# Altium schematic sheet Power.SchDoc
size A4
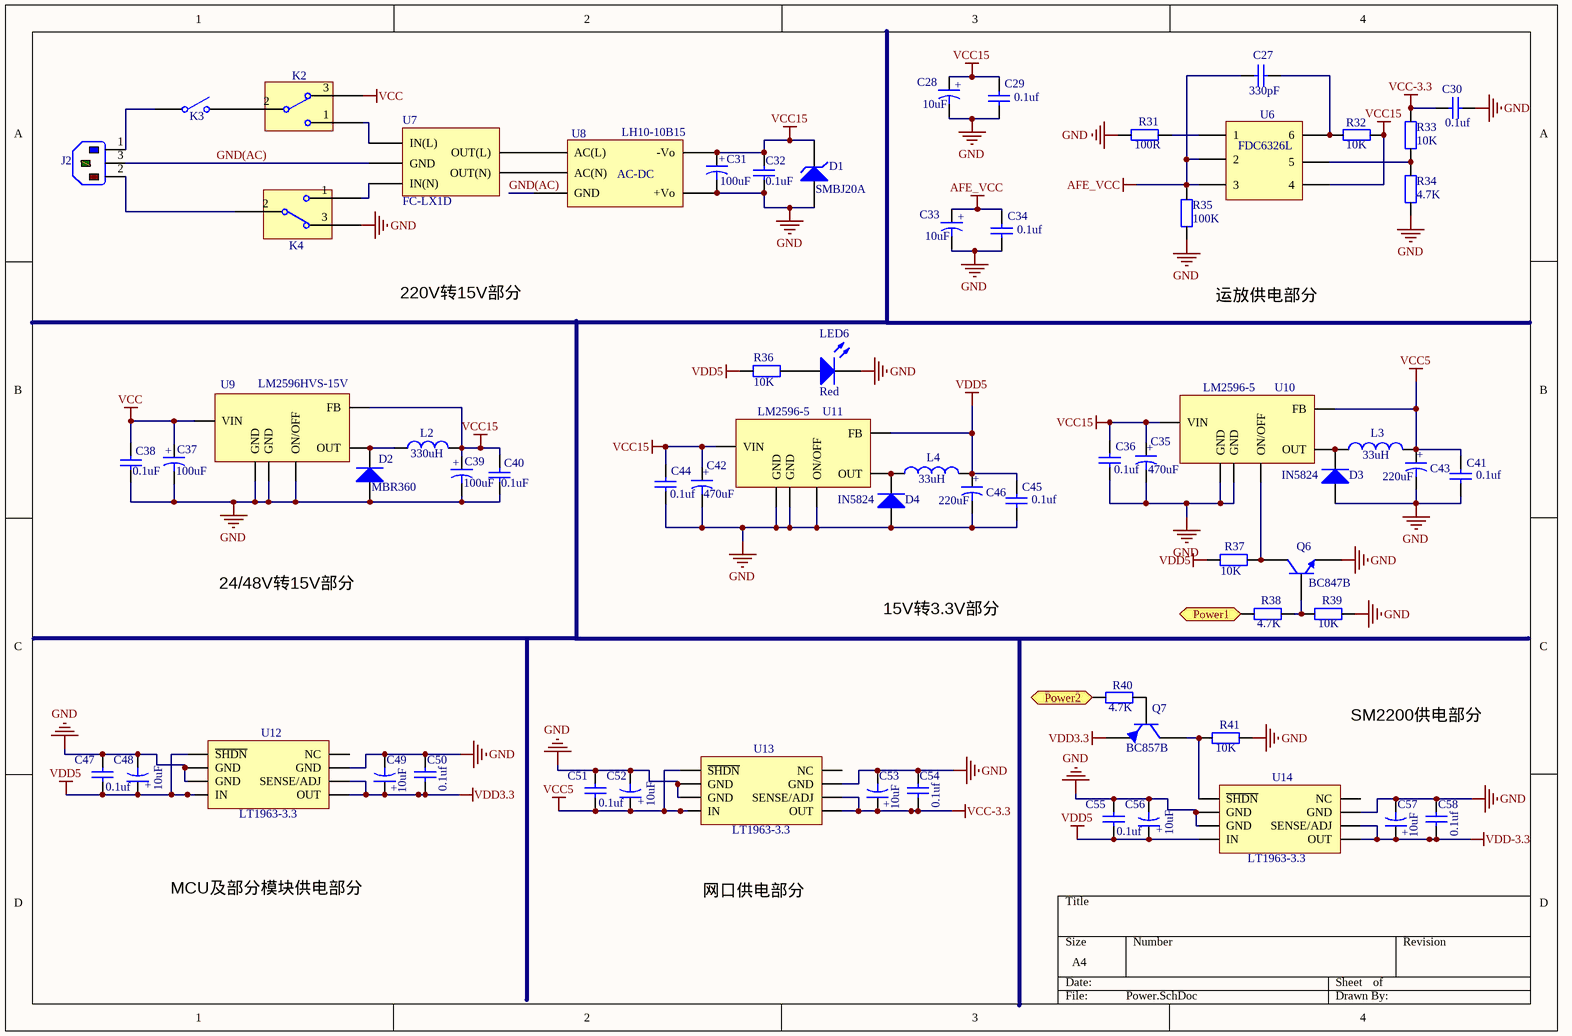
[diagram p0: Power.SchDoc]

## Parts
C27  value 330pF  [0603]  (hidden comment: Capacitor-0805)
C28  value 10uF  [3528]  (hidden comment: 电解电容)
C29  value 0.1uf  [0805]  (hidden comment: Capacitor-0805)
C30  value 0.1uf  [0603]  (hidden comment: Capacitor-0805)
C31  value 100uF  [贴片铝电容-8*10.3]  (hidden comment: 电解电容)
C32  value 0.1uF  [0805]  (hidden comment: Capacitor-0805)
C33  value 10uF  [3528]  (hidden comment: 电解电容)
C34  value 0.1uf  [0805]  (hidden comment: Capacitor-0805)
C35  value 470uF  [贴片铝电容-10*10]  (hidden comment: 电解电容)
C36  value 0.1uf  [0805]  (hidden comment: Capacitor-0805)
C37  value 100uF  [贴片铝电容-8*10.3]  (hidden comment: 电解电容)
C38  value 0.1uF  [0805]  (hidden comment: Capacitor-0805)
C39  value 100uF  [贴片铝电容-8*10.3]  (hidden comment: 电解电容)
C40  value 0.1uF  [0805]  (hidden comment: Capacitor-0805)
C41  value 0.1uf  [0805]  (hidden comment: Capacitor-0805)
C42  value 470uF  [贴片铝电容-10*10]  (hidden comment: 电解电容)
C43  value 220uF  [贴片铝电容-8*10.3]  (hidden comment: 电解电容)
C44  value 0.1uf  [0805]  (hidden comment: Capacitor-0805)
C45  value 0.1uf  [0805]  (hidden comment: Capacitor-0805)
C46  value 220uF  [贴片铝电容-8*10.3]  (hidden comment: 电解电容)
C47  value 0.1uf  [0805]  (hidden comment: Capacitor-0805)
C48  value 10uF  [钽电容1206（A3216）]  (hidden comment: 电解电容)
C49  value 10uF  [钽电容1206（A3216）]  (hidden comment: 电解电容)
C50  value 0.1uf  [0805]  (hidden comment: Capacitor-0805)
C51  value 0.1uf  [0805]  (hidden comment: Capacitor-0805)
C52  value 10uF  [钽电容1206（A3216）]  (hidden comment: 电解电容)
C53  value 10uF  [钽电容1206（A3216）]  (hidden comment: 电解电容)
C54  value 0.1uf  [0805]  (hidden comment: Capacitor-0805)
C55  value 0.1uf  [0805]  (hidden comment: Capacitor-0805)
C56  value 10uF  [钽电容1206（A3216）]  (hidden comment: 电解电容)
C57  value 10uF  [钽电容1206（A3216）]  (hidden comment: 电解电容)
C58  value 0.1uf  [0805]  (hidden comment: Capacitor-0805)
D1  SMBJ20A  [SMBJ20A]
D2  value MBR360  [IN5824]  (hidden comment: IN5824)
D3  IN5824  [IN5824]
D4  IN5824  [IN5824]
J2  三脚航空插头  [三脚航空插头]  (value not drawn)
K2  选择开关  [选择开关]  (value not drawn)
K3  开关  [T型接头]  (value not drawn)
K4  选择开关  [选择开关]  (value not drawn)
L2  value 330uH  [Inductor(7.8*7*5)]  (hidden comment: Inductor)
L3  value 33uH  [SLF6025   电感]  (hidden comment: Inductor)
L4  value 33uH  [SLF6025   电感]  (hidden comment: Inductor)
LED6  Color: Red  [外插小灯]  (hidden comment: LED)
Q6  BC847  [BC847B]  (value not drawn)
Q7  Name: BC857B  [BC847B]  (hidden comment: BC587B)
R31  value 100R  [0603]  (hidden comment: Resistor-0603)
R32  value 10K  [0603]  (hidden comment: Resistor-0603)
R33  value 10K  [0603]  (hidden comment: Resistor-0603)
R34  value 4.7K  [0603]  (hidden comment: Resistor-0603)
R35  value 100K  [0603]  (hidden comment: Resistor-0603)
R36  value 10K  [0603]  (hidden comment: Resistor-0603)
R37  value 10K  [0603]  (hidden comment: Resistor-0603)
R38  value 4.7K  [0603]  (hidden comment: Resistor-0603)
R39  value 10K  [0603]  (hidden comment: Resistor-0603)
R40  value 4.7K  [0603]  (hidden comment: Resistor-0603)
R41  value 10K  [0603]  (hidden comment: Resistor-0603)
U6  FDC6326L  [FDC6326L]
U7  FC-LX1D  [FC-LX1D]
U8  Describe: AC-DC  [LH10-10B15]  (hidden comment: LH10-10B15)
U9  value LM2596HVS-15V  [LM2596]  (hidden comment: LM2596)
U10  LM2596  [LM2596]  (value not drawn)
U11  LM2596  [LM2596]  (value not drawn)
U12  LT1963  [LT1963]  (value not drawn)
U13  LT1963  [LT1963]  (value not drawn)
U14  LT1963  [LT1963]  (value not drawn)

## Ports
Power1 (in), Power2 (in)

## Nets
AFE_VCC: C27.2 C33.2 C34.2 R35.2 U6.2 U6.3
GND: C28.1 C29.1 C30.1 C31.1 C32.1 C33.1 C34.1 C35.1 C36.1 C37.1 C38.1 C39.1 C40.1 C41.1 C42.1 C43.1 C44.1 C45.1 C46.1 C47.2 C48.1 C49.1 C50.2 C51.2 C52.1 C53.1 C54.2 C55.2 C56.1 C57.1 C58.2 D1.1(A) D2.1(A) D3.1(A) D4.1(A) K4.3 LED6.2 Q6.1(E) R31.1 R34.1 R35.1 R39.1 R41.1 U8.8(+Vo) U9.3(GND) U9.5(ON/OFF) U9.6(GND) U10.3(GND) U10.6(GND) U11.3(GND) U11.5(ON/OFF) U11.6(GND) U12.3(GND) U12.6(GND) U12.7(GND) U13.3(GND) U13.6(GND) U13.7(GND) U14.3(GND) U14.6(GND) U14.7(GND)
VCC: C37.2 C38.2 K2.3 U9.1(VIN)
VCC5: C41.2 C43.2 C51.1 C52.2 L3.2 U10.4(FB) U13.5(~{SHDN}) U13.8(IN)
VCC15: C28.2 C29.2 C31.2 C32.2 C35.2 C36.2 C39.2 C40.2 C42.2 C44.2 D1.2(K) L2.2 R32.1 U6.4 U8.4(-Vo) U9.4(FB) U10.1(VIN) U11.1(VIN)
VCC-3.3: C30.2 C53.2 C54.1 R33.2 U13.1(OUT) U13.2(SENSE/ADJ)
VDD3.3: C49.2 C50.1 Q7.1(E) U12.1(OUT) U12.2(SENSE/ADJ)
VDD5: C45.2 C46.2 C47.1 C48.2 C55.1 C56.2 L4.2 R36.2 R37.1 U11.4(FB) U12.5(~{SHDN}) U12.8(IN) U14.8(IN)
VDD-3.3: C57.2 C58.1 U14.1(OUT) U14.2(SENSE/ADJ)
GND(AC): J2.3 U7.1(GND) U8.1(GND)
Power1: R38.2 ; port Power1
Power2: R40.2 ; port Power2
NetC27_1: C27.1 R32.2 U6.6
NetD2_2: D2.2(K) L2.1 U9.2(OUT)
NetD3_2: D3.2(K) L3.1 U10.2(OUT)
NetD4_2: D4.2(K) L4.1 U11.2(OUT)
NetJ2_1: J2.1 K3.1(COMMON)
NetJ2_2: J2.2 K4.2
NetK2_1: K2.1 U7.3(IN(L))
NetK2_2: K2.2 K3.2(NO)
NetK4_1: K4.1 U7.2(IN(N))
NetLED6_1: LED6.1(A) R36.1
NetQ6_2: Q6.2(B) R38.1 R39.2
NetQ6_3: Q6.3(C) R37.2 U10.5(ON/OFF)
NetQ7_2: Q7.2(B) R40.1
NetQ7_3: Q7.3(C) R41.2 U14.5(~{SHDN})
NetR31_2: R31.2 U6.1
NetR33_1: R33.1 R34.2 U6.5
NetU7_4: U7.4(OUT(L)) U8.3(AC(L))
NetU7_5: U7.5(OUT(N)) U8.2(AC(N))

Not connected (* = marked no-connect by the designer): U12 4(NC); U13 4(NC); U14 4(NC)

## Notes on the sheet
- 220V转15V部分
- 运放供电部分
- 24/48V转15V部分
- 15V转3.3V部分
- SM2200供电部分
- MCU及部分模块供电部分
- 网口供电部分
- (in symbol L) LM2596-5; LT1963-3.3
- (in symbol 电解电容) +

## Library data of the parts
C27 C29 C30 C34 C36 C41 C44 C45 C47 C50 C51 C54 C55 C58 = Capacitor
D3 D4 = I
L3 L4 = Ind
U10-U14 = L
D1 = SMBJ20A: Name: SMBJ20A
LED6 = LED: Value: LED
Q6 = BC847: Name: BC847B
U6 = FDC6326L: Name: FDC6326L
U7 = FC-LX1D: Name: FC-LX1D
U8 = LH10-10B15: Name: LH10-10B15